# EAGLE schematic monroe-hi (EAGLE 6.3)
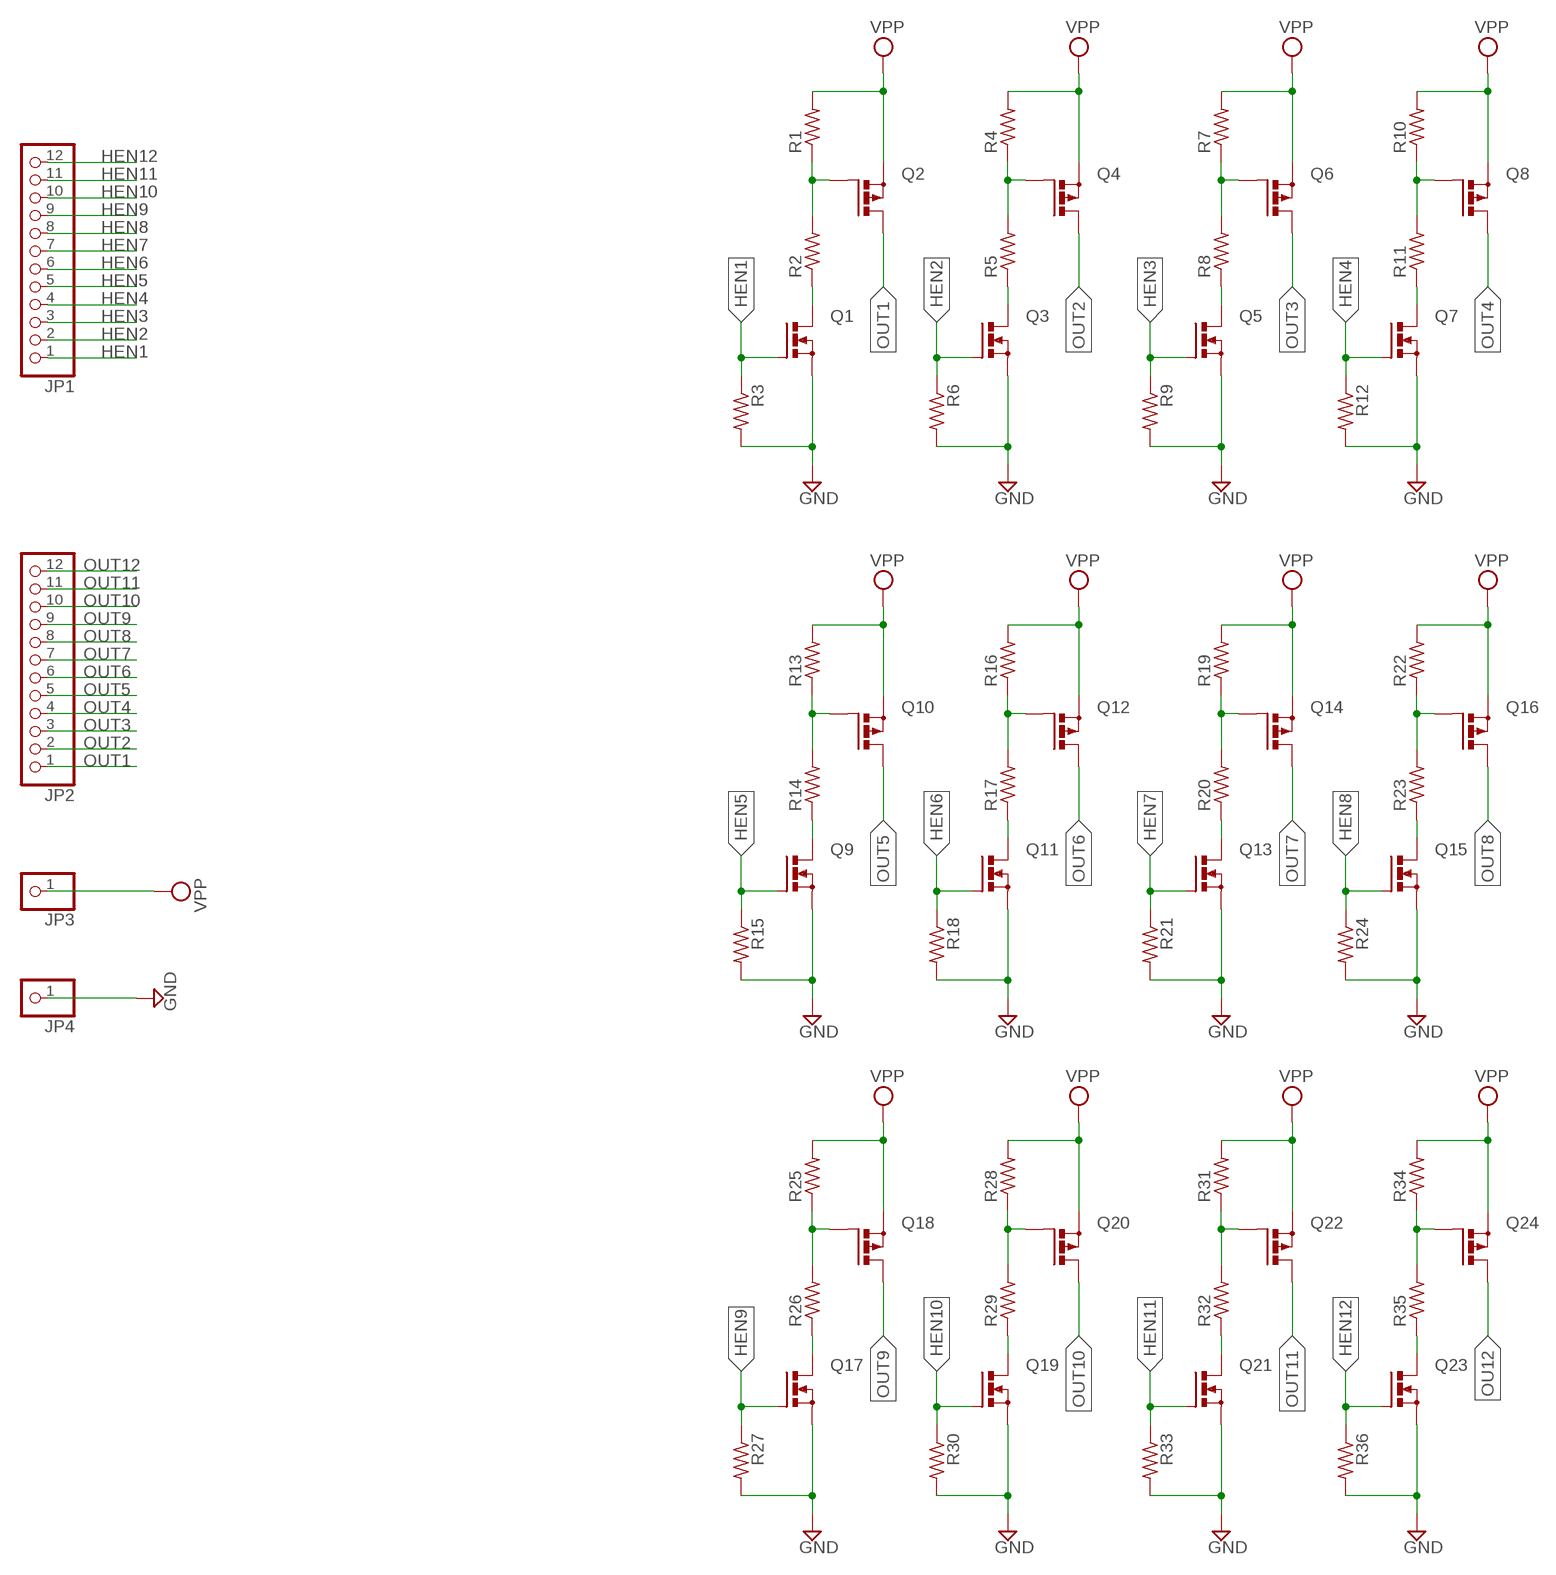
[diagram p0: schematic, sheet 1]

## Parts
JP1  PINHD-1X12  [1X12]
JP2  PINHD-1X12  [1X12]
JP3  PINHD-1X1  [1X01]
JP4  PINHD-1X1  [1X01]
Q1  PMOSFET_NTO220BV  [TO220BV]
Q2  PMOSFET_PTO220BV  [TO220BV]
Q3  PMOSFET_NTO220BV  [TO220BV]
Q4  PMOSFET_PTO220BV  [TO220BV]
Q5  PMOSFET_NTO220BV  [TO220BV]
Q6  PMOSFET_PTO220BV  [TO220BV]
Q7  PMOSFET_NTO220BV  [TO220BV]
Q8  PMOSFET_PTO220BV  [TO220BV]
Q9  PMOSFET_NTO220BV  [TO220BV]
Q10  PMOSFET_PTO220BV  [TO220BV]
Q11  PMOSFET_NTO220BV  [TO220BV]
Q12  PMOSFET_PTO220BV  [TO220BV]
Q13  PMOSFET_NTO220BV  [TO220BV]
Q14  PMOSFET_PTO220BV  [TO220BV]
Q15  PMOSFET_NTO220BV  [TO220BV]
Q16  PMOSFET_PTO220BV  [TO220BV]
Q17  PMOSFET_NTO220BV  [TO220BV]
Q18  PMOSFET_PTO220BV  [TO220BV]
Q19  PMOSFET_NTO220BV  [TO220BV]
Q20  PMOSFET_PTO220BV  [TO220BV]
Q21  PMOSFET_NTO220BV  [TO220BV]
Q22  PMOSFET_PTO220BV  [TO220BV]
Q23  PMOSFET_NTO220BV  [TO220BV]
Q24  PMOSFET_PTO220BV  [TO220BV]
R1  R-US_0207/5V  [0207/5V]
R2  R-US_0207/5V  [0207/5V]
R3  R-US_0207/5V  [0207/5V]
R4  R-US_0207/5V  [0207/5V]
R5  R-US_0207/5V  [0207/5V]
R6  R-US_0207/5V  [0207/5V]
R7  R-US_0207/5V  [0207/5V]
R8  R-US_0207/5V  [0207/5V]
R9  R-US_0207/5V  [0207/5V]
R10  R-US_0207/5V  [0207/5V]
R11  R-US_0207/5V  [0207/5V]
R12  R-US_0207/5V  [0207/5V]
R13  R-US_0207/5V  [0207/5V]
R14  R-US_0207/5V  [0207/5V]
R15  R-US_0207/5V  [0207/5V]
R16  R-US_0207/5V  [0207/5V]
R17  R-US_0207/5V  [0207/5V]
R18  R-US_0207/5V  [0207/5V]
R19  R-US_0207/5V  [0207/5V]
R20  R-US_0207/5V  [0207/5V]
R21  R-US_0207/5V  [0207/5V]
R22  R-US_0207/5V  [0207/5V]
R23  R-US_0207/5V  [0207/5V]
R24  R-US_0207/5V  [0207/5V]
R25  R-US_0207/5V  [0207/5V]
R26  R-US_0207/5V  [0207/5V]
R27  R-US_0207/5V  [0207/5V]
R28  R-US_0207/5V  [0207/5V]
R29  R-US_0207/5V  [0207/5V]
R30  R-US_0207/5V  [0207/5V]
R31  R-US_0207/5V  [0207/5V]
R32  R-US_0207/5V  [0207/5V]
R33  R-US_0207/5V  [0207/5V]
R34  R-US_0207/5V  [0207/5V]
R35  R-US_0207/5V  [0207/5V]
R36  R-US_0207/5V  [0207/5V]

## Nets
GND: JP4.1 Q1.S Q3.S Q5.S Q7.S Q9.S Q11.S Q13.S Q15.S Q17.S Q19.S Q21.S Q23.S R3.2 R6.2 R9.2 R12.2 R15.2 R18.2 R21.2 R24.2 R27.2 R30.2 R33.2 R36.2
HEN1: JP1.1 Q1.G R3.1
HEN2: JP1.2 Q3.G R6.1
HEN3: JP1.3 Q5.G R9.1
HEN4: JP1.4 Q7.G R12.1
HEN5: JP1.5 Q9.G R15.1
HEN6: JP1.6 Q11.G R18.1
HEN7: JP1.7 Q13.G R21.1
HEN8: JP1.8 Q15.G R24.1
HEN9: JP1.9 Q17.G R27.1
HEN10: JP1.10 Q19.G R30.1
HEN11: JP1.11 Q21.G R33.1
HEN12: JP1.12 Q23.G R36.1
N$1: Q2.G R1.1 R2.2
N$2: Q1.D R2.1
N$3: Q4.G R4.1 R5.2
N$4: Q3.D R5.1
N$5: Q6.G R7.1 R8.2
N$6: Q5.D R8.1
N$7: Q8.G R10.1 R11.2
N$8: Q7.D R11.1
N$9: Q10.G R13.1 R14.2
N$10: Q9.D R14.1
N$11: Q12.G R16.1 R17.2
N$12: Q11.D R17.1
N$13: Q14.G R19.1 R20.2
N$14: Q13.D R20.1
N$15: Q16.G R22.1 R23.2
N$16: Q15.D R23.1
N$17: Q18.G R25.1 R26.2
N$18: Q17.D R26.1
N$19: Q20.G R28.1 R29.2
N$20: Q19.D R29.1
N$21: Q22.G R31.1 R32.2
N$22: Q21.D R32.1
N$23: Q24.G R34.1 R35.2
N$24: Q23.D R35.1
OU12: Q24.D
OUT1: JP2.1 Q2.D
OUT2: JP2.2 Q4.D
OUT3: JP2.3 Q6.D
OUT4: JP2.4 Q8.D
OUT5: JP2.5 Q10.D
OUT6: JP2.6 Q12.D
OUT7: JP2.7 Q14.D
OUT8: JP2.8 Q16.D
OUT9: JP2.9 Q18.D
OUT10: JP2.10 Q20.D
OUT11: JP2.11 Q22.D
OUT12: JP2.12
VPP: JP3.1 Q2.S Q4.S Q6.S Q8.S Q10.S Q12.S Q14.S Q16.S Q18.S Q20.S Q22.S Q24.S R1.2 R4.2 R7.2 R10.2 R13.2 R16.2 R19.2 R22.2 R25.2 R28.2 R31.2 R34.2

## Library data of the parts
JP1 JP2 = pinhead:PINHD-1X12: PIN HEADER
JP3 JP4 = pinhead:PINHD-1X1: PIN HEADER
Q1 Q3 Q5 Q7 Q9 Q11 Q13 Q15 Q17 Q19 Q21 Q23 = transistor-power:PMOSFET_N: Power MOSFET N-Channel
Q2 Q4 Q6 Q8 Q10 Q12 Q14 Q16 Q18 Q20 Q22 Q24 = transistor-power:PMOSFET_P: Power MOSFET P-Channel
R1-R36 = rcl:R-US_: RESISTOR, American symbol